# Altium schematic sheet Sheet2s.SchDoc
size A1; PageSetup: Record=PageOptions|CenterHorizontal=True|CenterVertical=True|PrintScale=0.37|XCorrection=1.00|YCorrection=1.00|PrintKind=1|BorderSize=5000000|LeftOffset=0|BottomOffset=0|Orientation=2|PaperLength=1000|PaperWidth=1000|Scale=100|PaperSource=7|PrintQuality=-4|MediaType=1|DitherType=10|PaperKind=16K 184 на 260 мм¦PrintScaleMode=1
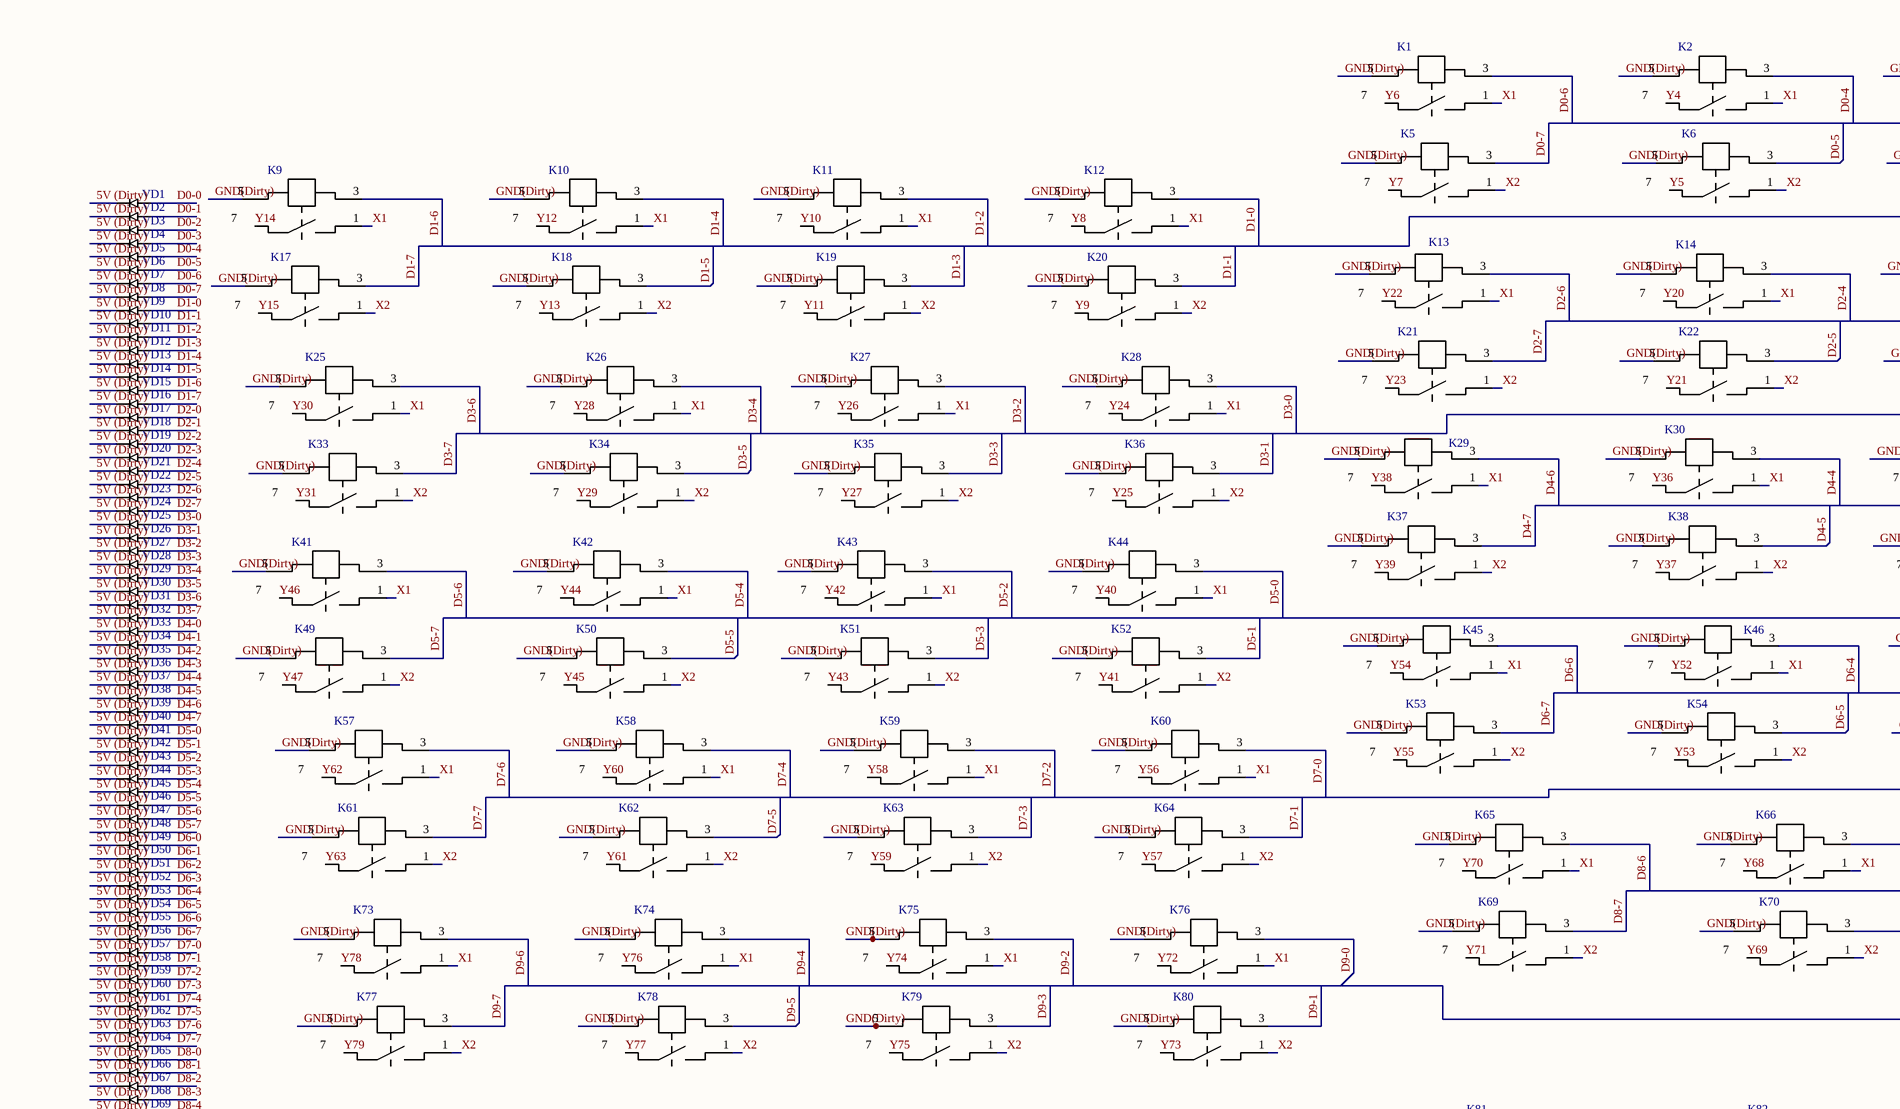
[diagram p0: Sheet2s.SchDoc, top left]
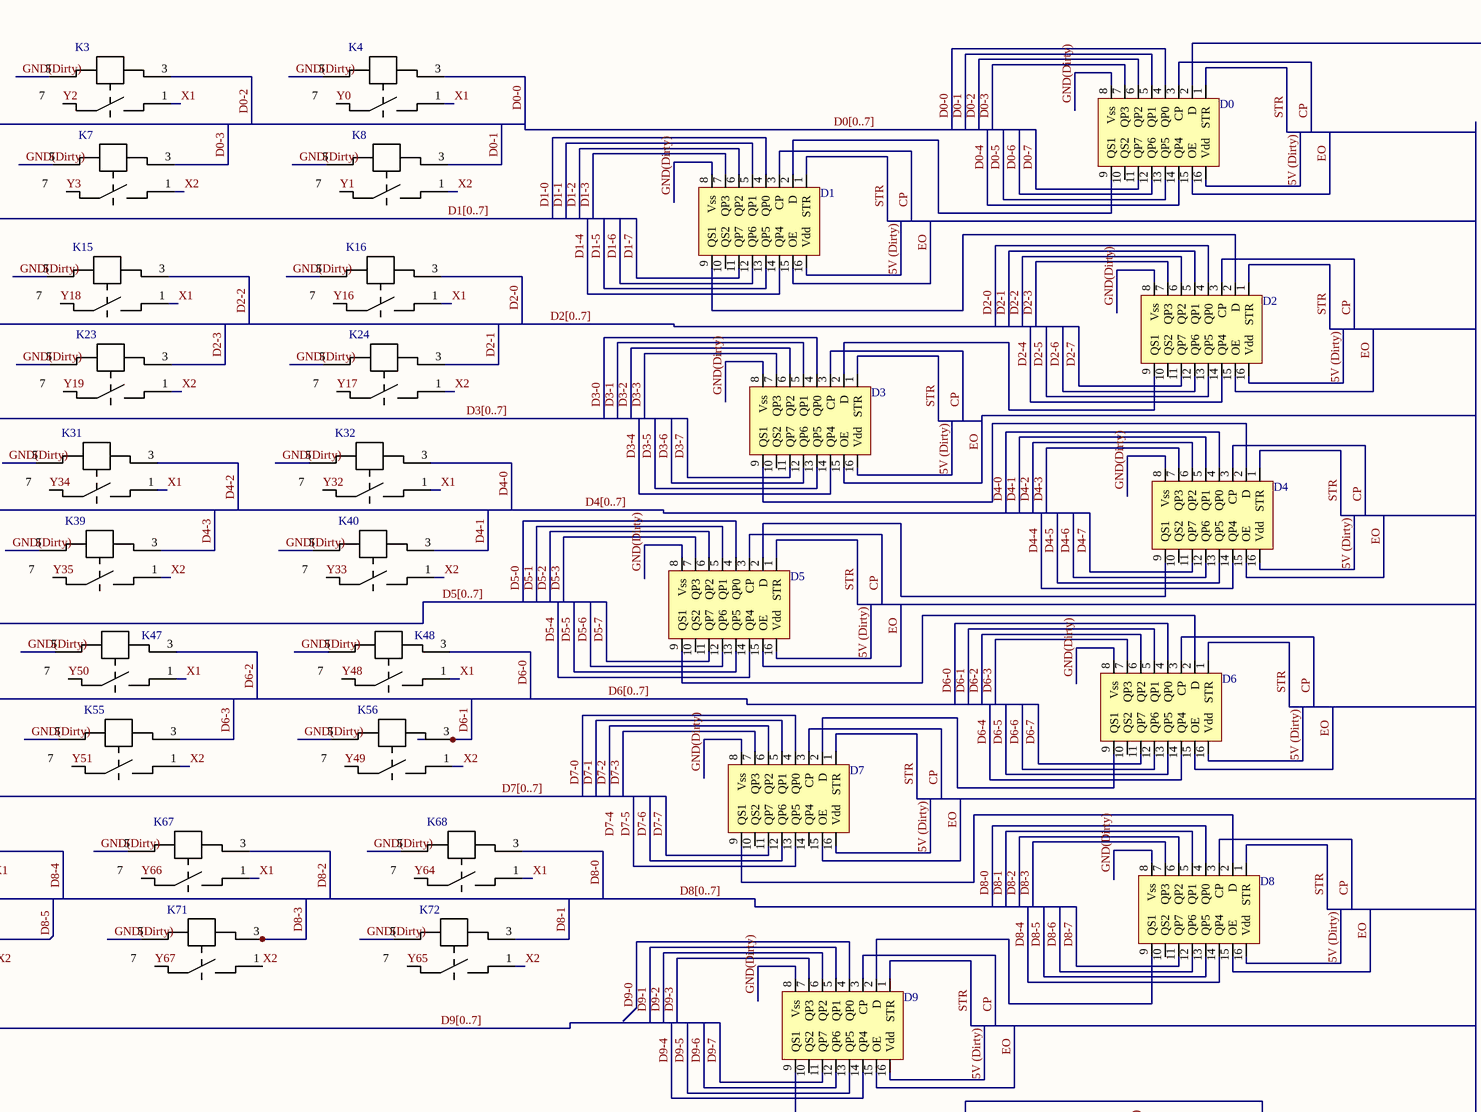
[diagram p1: Sheet2s.SchDoc, top right]
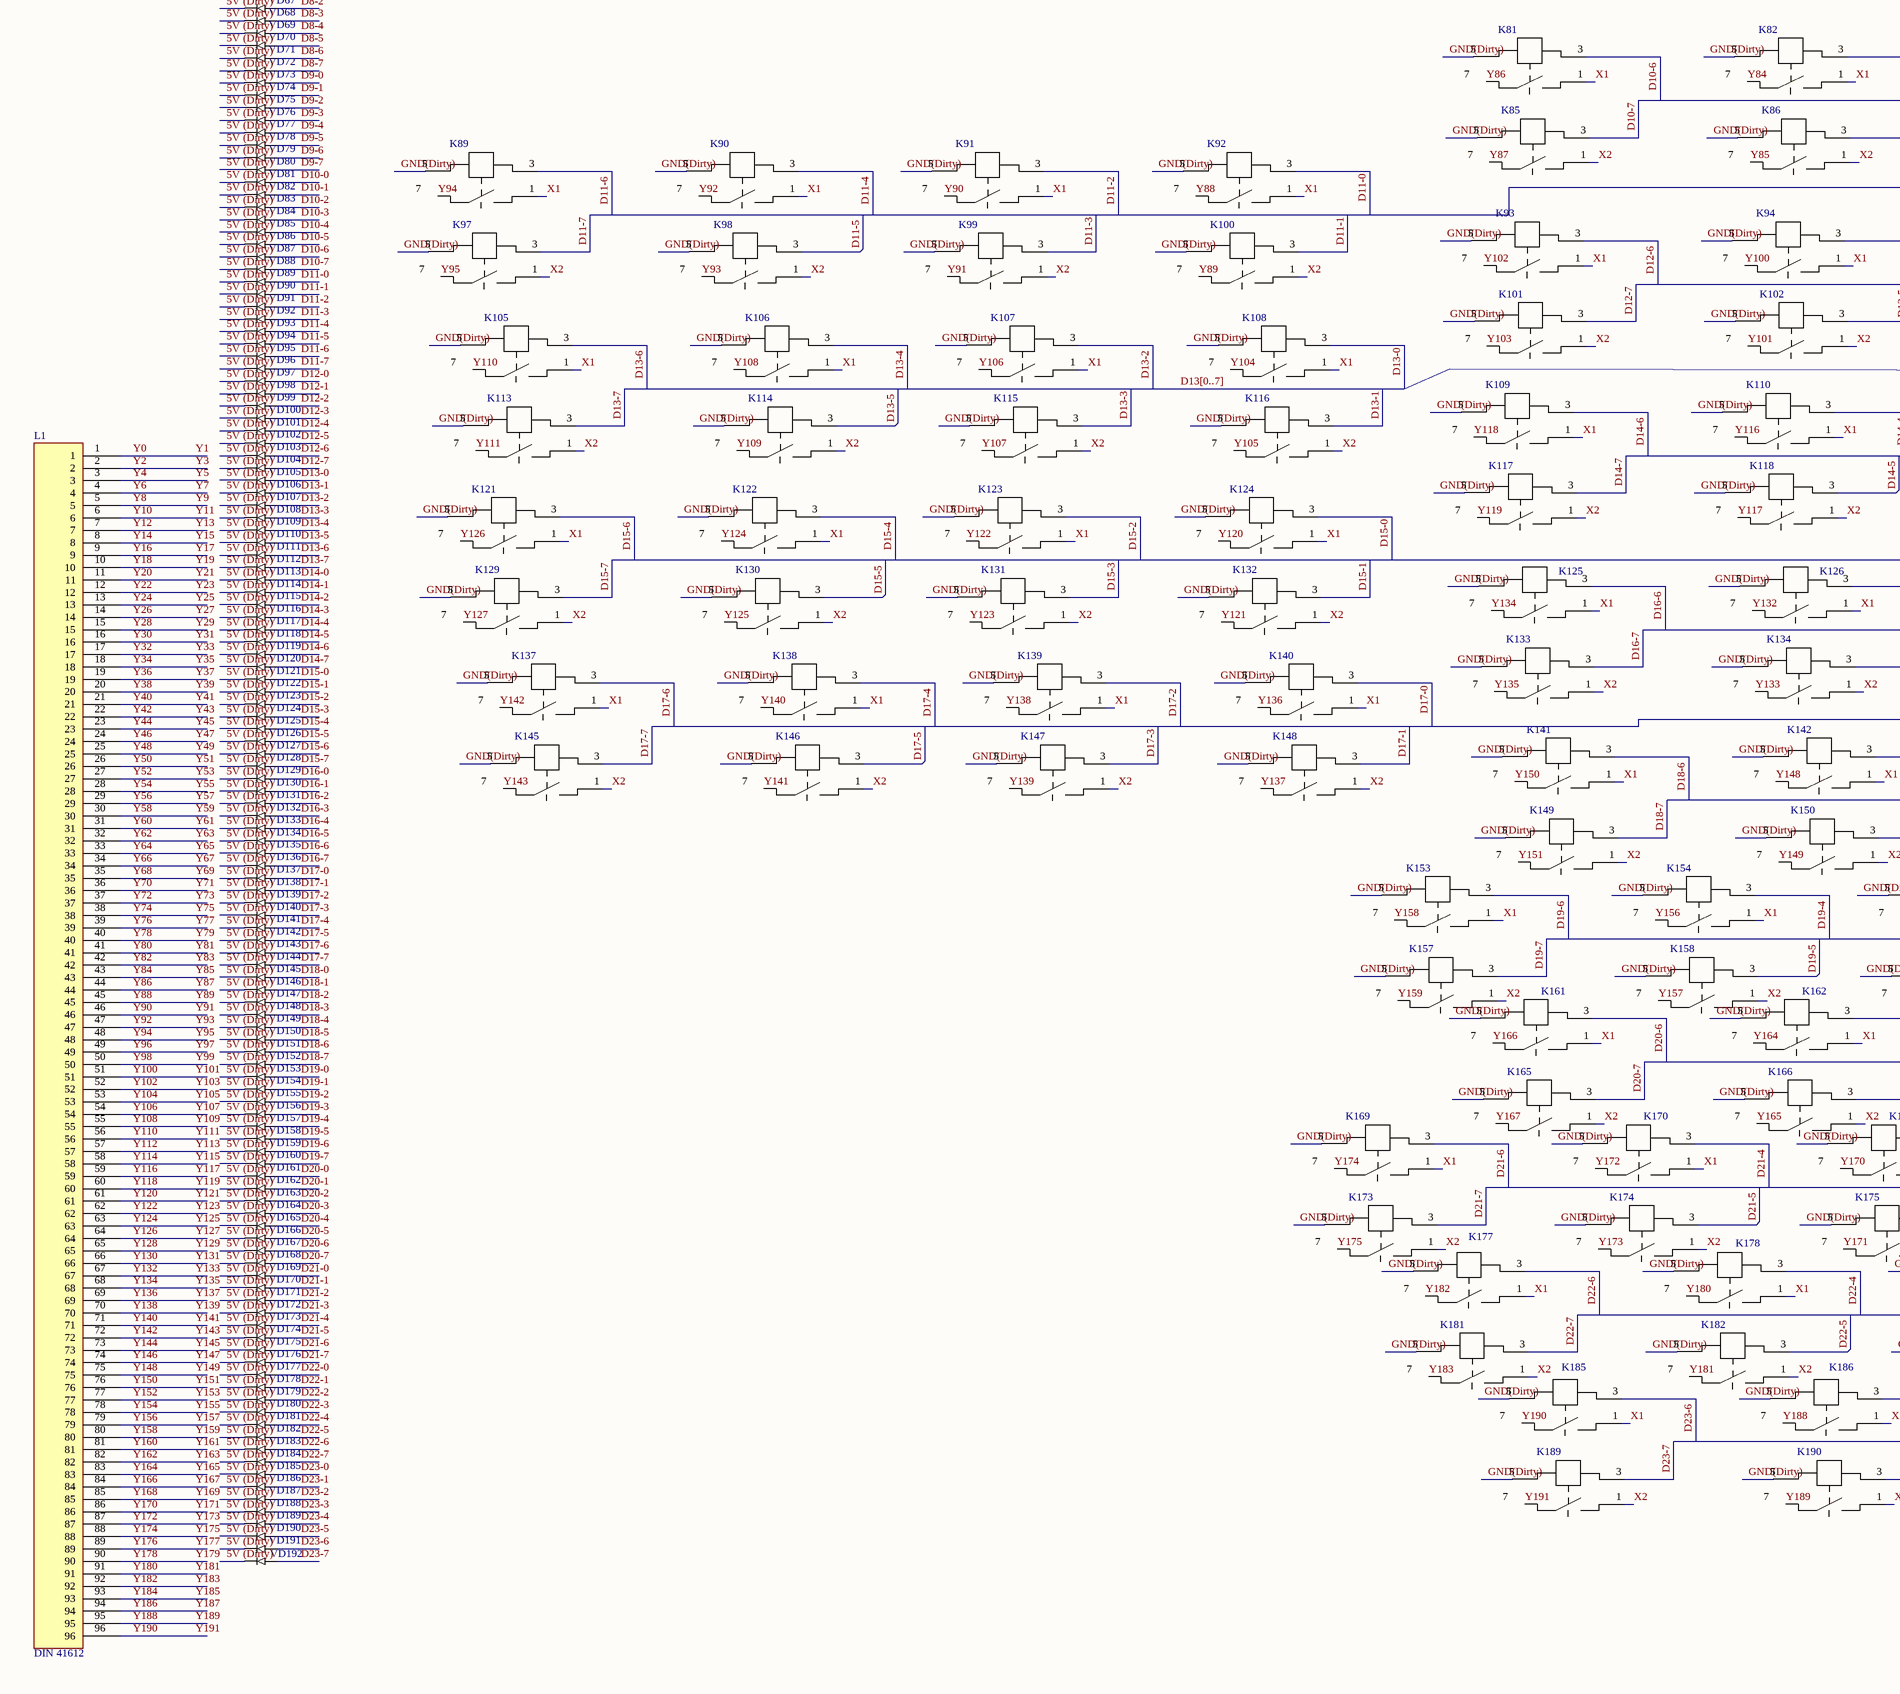
[diagram p2: Sheet2s.SchDoc, bottom left]
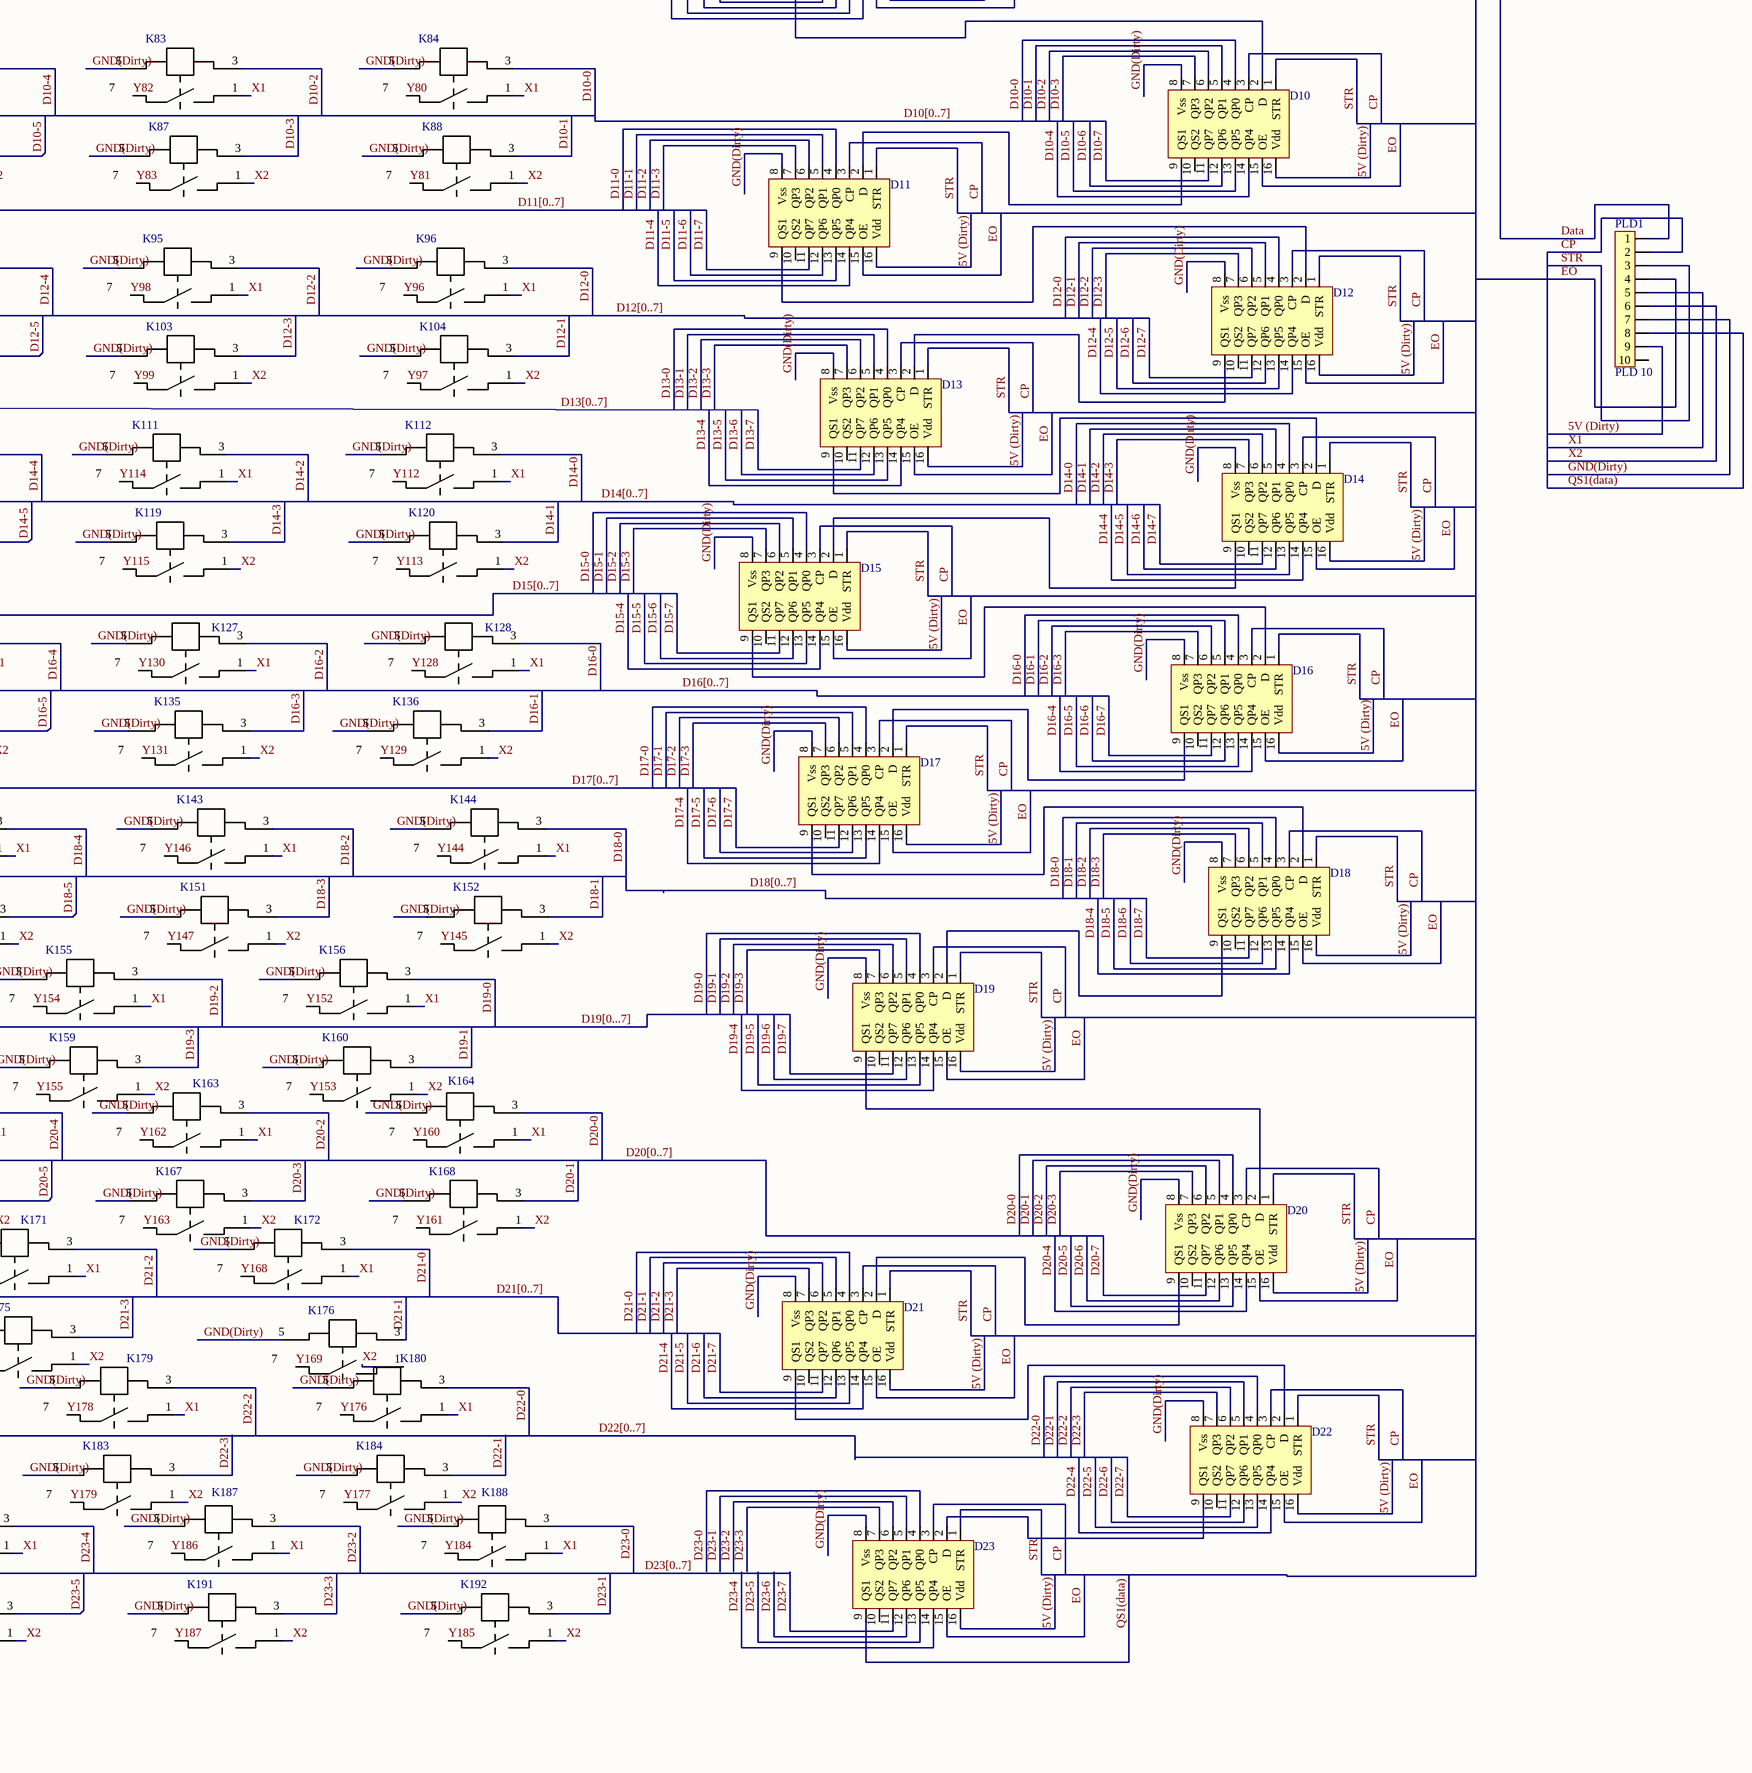
[diagram p3: Sheet2s.SchDoc, bottom right]

## Parts
D0  (no value)  [SOP127P600X175-16N]
D1  (no value)  [SOP127P600X175-16N]
D2  (no value)  [SOP127P600X175-16N]
D3  (no value)  [SOP127P600X175-16N]
D4  (no value)  [SOP127P600X175-16N]
D5  (no value)  [SOP127P600X175-16N]
D6  (no value)  [SOP127P600X175-16N]
D7  (no value)  [SOP127P600X175-16N]
D8  (no value)  [SOP127P600X175-16N]
D9  (no value)  [SOP127P600X175-16N]
D10  (no value)  [SOP127P600X175-16N]
D11  (no value)  [SOP127P600X175-16N]
D12  (no value)  [SOP127P600X175-16N]
D13  (no value)  [SOP127P600X175-16N]
D14  (no value)  [SOP127P600X175-16N]
D15  (no value)  [SOP127P600X175-16N]
D16  (no value)  [SOP127P600X175-16N]
D17  (no value)  [SOP127P600X175-16N]
D18  (no value)  [SOP127P600X175-16N]
D19  (no value)  [SOP127P600X175-16N]
D20  (no value)  [SOP127P600X175-16N]
D21  (no value)  [SOP127P600X175-16N]
D22  (no value)  [SOP127P600X175-16N]
D23  (no value)  [SOP127P600X175-16N]
K1  (no value)  [TTR-реле]
K2  (no value)  [TTR-реле]
K3  (no value)  [TTR-реле]
K4  (no value)  [TTR-реле]
K5  (no value)  [TTR-реле]
K6  (no value)  [TTR-реле]
K7  (no value)  [TTR-реле]
K8  (no value)  [TTR-реле]
K9  (no value)  [TTR-реле]
K10  (no value)  [TTR-реле]
K11  (no value)  [TTR-реле]
K12  (no value)  [TTR-реле]
K13  (no value)  [TTR-реле]
K14  (no value)  [TTR-реле]
K15  (no value)  [TTR-реле]
K16  (no value)  [TTR-реле]
K17  (no value)  [TTR-реле]
K18  (no value)  [TTR-реле]
K19  (no value)  [TTR-реле]
K20  (no value)  [TTR-реле]
K21  (no value)  [TTR-реле]
K22  (no value)  [TTR-реле]
K23  (no value)  [TTR-реле]
K24  (no value)  [TTR-реле]
K25  (no value)  [TTR-реле]
K26  (no value)  [TTR-реле]
K27  (no value)  [TTR-реле]
K28  (no value)  [TTR-реле]
K29  (no value)  [TTR-реле]
K30  (no value)  [TTR-реле]
K31  (no value)  [TTR-реле]
K32  (no value)  [TTR-реле]
K33  (no value)  [TTR-реле]
K34  (no value)  [TTR-реле]
K35  (no value)  [TTR-реле]
K36  (no value)  [TTR-реле]
K37  (no value)  [TTR-реле]
K38  (no value)  [TTR-реле]
K39  (no value)  [TTR-реле]
K40  (no value)  [TTR-реле]
K41  (no value)  [TTR-реле]
K42  (no value)  [TTR-реле]
K43  (no value)  [TTR-реле]
K44  (no value)  [TTR-реле]
K45  (no value)  [TTR-реле]
K46  (no value)  [TTR-реле]
K47  (no value)  [TTR-реле]
K48  (no value)  [TTR-реле]
K49  (no value)  [TTR-реле]
K50  (no value)  [TTR-реле]
K51  (no value)  [TTR-реле]
K52  (no value)  [TTR-реле]
K53  (no value)  [TTR-реле]
K54  (no value)  [TTR-реле]
K55  (no value)  [TTR-реле]
K56  (no value)  [TTR-реле]
K57  (no value)  [TTR-реле]
K58  (no value)  [TTR-реле]
K59  (no value)  [TTR-реле]
K60  (no value)  [TTR-реле]
K61  (no value)  [TTR-реле]
K62  (no value)  [TTR-реле]
K63  (no value)  [TTR-реле]
K64  (no value)  [TTR-реле]
K65  (no value)  [TTR-реле]
K66  (no value)  [TTR-реле]
K67  (no value)  [TTR-реле]
K68  (no value)  [TTR-реле]
K69  (no value)  [TTR-реле]
K70  (no value)  [TTR-реле]
K71  (no value)  [TTR-реле]
K72  (no value)  [TTR-реле]
K73  (no value)  [TTR-реле]
K74  (no value)  [TTR-реле]
K75  (no value)  [TTR-реле]
K76  (no value)  [TTR-реле]
K77  (no value)  [TTR-реле]
K78  (no value)  [TTR-реле]
K79  (no value)  [TTR-реле]
K80  (no value)  [TTR-реле]
K81  (no value)  [TTR-реле]
K82  (no value)  [TTR-реле]
K83  (no value)  [TTR-реле]
K84  (no value)  [TTR-реле]
K85  (no value)  [TTR-реле]
K86  (no value)  [TTR-реле]
K87  (no value)  [TTR-реле]
K88  (no value)  [TTR-реле]
K89  (no value)  [TTR-реле]
K90  (no value)  [TTR-реле]
K91  (no value)  [TTR-реле]
K92  (no value)  [TTR-реле]
K93  (no value)  [TTR-реле]
K94  (no value)  [TTR-реле]
K95  (no value)  [TTR-реле]
K96  (no value)  [TTR-реле]
K97  (no value)  [TTR-реле]
K98  (no value)  [TTR-реле]
K99  (no value)  [TTR-реле]
K100  (no value)  [TTR-реле]
K101  (no value)  [TTR-реле]
K102  (no value)  [TTR-реле]
K103  (no value)  [TTR-реле]
K104  (no value)  [TTR-реле]
K105  (no value)  [TTR-реле]
K106  (no value)  [TTR-реле]
K107  (no value)  [TTR-реле]
K108  (no value)  [TTR-реле]
K109  (no value)  [TTR-реле]
K110  (no value)  [TTR-реле]
K111  (no value)  [TTR-реле]
K112  (no value)  [TTR-реле]
K113  (no value)  [TTR-реле]
K114  (no value)  [TTR-реле]
K115  (no value)  [TTR-реле]
K116  (no value)  [TTR-реле]
K117  (no value)  [TTR-реле]
K118  (no value)  [TTR-реле]
K119  (no value)  [TTR-реле]
K120  (no value)  [TTR-реле]
K121  (no value)  [TTR-реле]
K122  (no value)  [TTR-реле]
K123  (no value)  [TTR-реле]
K124  (no value)  [TTR-реле]
K125  (no value)  [TTR-реле]
K126  (no value)  [TTR-реле]
K127  (no value)  [TTR-реле]
K128  (no value)  [TTR-реле]
K129  (no value)  [TTR-реле]
K130  (no value)  [TTR-реле]
K131  (no value)  [TTR-реле]
K132  (no value)  [TTR-реле]
K133  (no value)  [TTR-реле]
K134  (no value)  [TTR-реле]
K135  (no value)  [TTR-реле]
K136  (no value)  [TTR-реле]
K137  (no value)  [TTR-реле]
K138  (no value)  [TTR-реле]
K139  (no value)  [TTR-реле]
K140  (no value)  [TTR-реле]
K141  (no value)  [TTR-реле]
K142  (no value)  [TTR-реле]
K143  (no value)  [TTR-реле]
K144  (no value)  [TTR-реле]
K145  (no value)  [TTR-реле]
K146  (no value)  [TTR-реле]
K147  (no value)  [TTR-реле]
K148  (no value)  [TTR-реле]
K149  (no value)  [TTR-реле]
K150  (no value)  [TTR-реле]
K151  (no value)  [TTR-реле]
K152  (no value)  [TTR-реле]
K153  (no value)  [TTR-реле]
K154  (no value)  [TTR-реле]
K155  (no value)  [TTR-реле]
K156  (no value)  [TTR-реле]
K157  (no value)  [TTR-реле]
K158  (no value)  [TTR-реле]
K159  (no value)  [TTR-реле]
K160  (no value)  [TTR-реле]
K161  (no value)  [TTR-реле]
K162  (no value)  [TTR-реле]
K163  (no value)  [TTR-реле]
K164  (no value)  [TTR-реле]
K165  (no value)  [TTR-реле]
K166  (no value)  [TTR-реле]
K167  (no value)  [TTR-реле]
K168  (no value)  [TTR-реле]
K169  (no value)  [TTR-реле]
K170  (no value)  [TTR-реле]
K171  (no value)  [TTR-реле]
K172  (no value)  [TTR-реле]
K173  (no value)  [TTR-реле]
K174  (no value)  [TTR-реле]
K175  (no value)  [TTR-реле]
K176  (no value)  [TTR-реле]
K177  (no value)  [TTR-реле]
K178  (no value)  [TTR-реле]
K179  (no value)  [TTR-реле]
K180  (no value)  [TTR-реле]
K181  (no value)  [TTR-реле]
K182  (no value)  [TTR-реле]
K183  (no value)  [TTR-реле]
K184  (no value)  [TTR-реле]
K185  (no value)  [TTR-реле]
K186  (no value)  [TTR-реле]
K187  (no value)  [TTR-реле]
K188  (no value)  [TTR-реле]
K189  (no value)  [TTR-реле]
K190  (no value)  [TTR-реле]
K191  (no value)  [TTR-реле]
K192  (no value)  [TTR-реле]
L1  DIN 41612  [DIN41612]
PLD1  PLD 10  [PLD 10]
VD1  BAS216  [BAS216]  (value not drawn)
VD2  BAS216  [BAS216]  (value not drawn)
VD3  BAS216  [BAS216]  (value not drawn)
VD4  BAS216  [BAS216]  (value not drawn)
VD5  BAS216  [BAS216]  (value not drawn)
VD6  BAS216  [BAS216]  (value not drawn)
VD7  BAS216  [BAS216]  (value not drawn)
VD8  BAS216  [BAS216]  (value not drawn)
VD9  BAS216  [BAS216]  (value not drawn)
VD10  BAS216  [BAS216]  (value not drawn)
VD11  BAS216  [BAS216]  (value not drawn)
VD12  BAS216  [BAS216]  (value not drawn)
VD13  BAS216  [BAS216]  (value not drawn)
VD14  BAS216  [BAS216]  (value not drawn)
VD15  BAS216  [BAS216]  (value not drawn)
VD16  BAS216  [BAS216]  (value not drawn)
VD17  BAS216  [BAS216]  (value not drawn)
VD18  BAS216  [BAS216]  (value not drawn)
VD19  BAS216  [BAS216]  (value not drawn)
VD20  BAS216  [BAS216]  (value not drawn)
VD21  BAS216  [BAS216]  (value not drawn)
VD22  BAS216  [BAS216]  (value not drawn)
VD23  BAS216  [BAS216]  (value not drawn)
VD24  BAS216  [BAS216]  (value not drawn)
VD25  BAS216  [BAS216]  (value not drawn)
VD26  BAS216  [BAS216]  (value not drawn)
VD27  BAS216  [BAS216]  (value not drawn)
VD28  BAS216  [BAS216]  (value not drawn)
VD29  BAS216  [BAS216]  (value not drawn)
VD30  BAS216  [BAS216]  (value not drawn)
VD31  BAS216  [BAS216]  (value not drawn)
VD32  BAS216  [BAS216]  (value not drawn)
VD33  BAS216  [BAS216]  (value not drawn)
VD34  BAS216  [BAS216]  (value not drawn)
VD35  BAS216  [BAS216]  (value not drawn)
VD36  BAS216  [BAS216]  (value not drawn)
VD37  BAS216  [BAS216]  (value not drawn)
VD38  BAS216  [BAS216]  (value not drawn)
VD39  BAS216  [BAS216]  (value not drawn)
VD40  BAS216  [BAS216]  (value not drawn)
VD41  BAS216  [BAS216]  (value not drawn)
VD42  BAS216  [BAS216]  (value not drawn)
VD43  BAS216  [BAS216]  (value not drawn)
VD44  BAS216  [BAS216]  (value not drawn)
VD45  BAS216  [BAS216]  (value not drawn)
VD46  BAS216  [BAS216]  (value not drawn)
VD47  BAS216  [BAS216]  (value not drawn)
VD48  BAS216  [BAS216]  (value not drawn)
VD49  BAS216  [BAS216]  (value not drawn)
VD50  BAS216  [BAS216]  (value not drawn)
VD51  BAS216  [BAS216]  (value not drawn)
VD52  BAS216  [BAS216]  (value not drawn)
VD53  BAS216  [BAS216]  (value not drawn)
VD54  BAS216  [BAS216]  (value not drawn)
VD55  BAS216  [BAS216]  (value not drawn)
VD56  BAS216  [BAS216]  (value not drawn)
VD57  BAS216  [BAS216]  (value not drawn)
VD58  BAS216  [BAS216]  (value not drawn)
VD59  BAS216  [BAS216]  (value not drawn)
VD60  BAS216  [BAS216]  (value not drawn)
VD61  BAS216  [BAS216]  (value not drawn)
VD62  BAS216  [BAS216]  (value not drawn)
VD63  BAS216  [BAS216]  (value not drawn)
VD64  BAS216  [BAS216]  (value not drawn)
VD65  BAS216  [BAS216]  (value not drawn)
VD66  BAS216  [BAS216]  (value not drawn)
VD67  BAS216  [BAS216]  (value not drawn)
VD68  BAS216  [BAS216]  (value not drawn)
VD69  BAS216  [BAS216]  (value not drawn)
VD70  BAS216  [BAS216]  (value not drawn)
VD71  BAS216  [BAS216]  (value not drawn)
VD72  BAS216  [BAS216]  (value not drawn)
VD73  BAS216  [BAS216]  (value not drawn)
VD74  BAS216  [BAS216]  (value not drawn)
VD75  BAS216  [BAS216]  (value not drawn)
VD76  BAS216  [BAS216]  (value not drawn)
VD77  BAS216  [BAS216]  (value not drawn)
VD78  BAS216  [BAS216]  (value not drawn)
VD79  BAS216  [BAS216]  (value not drawn)
VD80  BAS216  [BAS216]  (value not drawn)
VD81  BAS216  [BAS216]  (value not drawn)
VD82  BAS216  [BAS216]  (value not drawn)
VD83  BAS216  [BAS216]  (value not drawn)
VD84  BAS216  [BAS216]  (value not drawn)
VD85  BAS216  [BAS216]  (value not drawn)
VD86  BAS216  [BAS216]  (value not drawn)
VD87  BAS216  [BAS216]  (value not drawn)
VD88  BAS216  [BAS216]  (value not drawn)
VD89  BAS216  [BAS216]  (value not drawn)
VD90  BAS216  [BAS216]  (value not drawn)
VD91  BAS216  [BAS216]  (value not drawn)
VD92  BAS216  [BAS216]  (value not drawn)
VD93  BAS216  [BAS216]  (value not drawn)
VD94  BAS216  [BAS216]  (value not drawn)
VD95  BAS216  [BAS216]  (value not drawn)
VD96  BAS216  [BAS216]  (value not drawn)
VD97  BAS216  [BAS216]  (value not drawn)
VD98  BAS216  [BAS216]  (value not drawn)
VD99  BAS216  [BAS216]  (value not drawn)
VD100  BAS216  [BAS216]  (value not drawn)
VD101  BAS216  [BAS216]  (value not drawn)
VD102  BAS216  [BAS216]  (value not drawn)
VD103  BAS216  [BAS216]  (value not drawn)
VD104  BAS216  [BAS216]  (value not drawn)
VD105  BAS216  [BAS216]  (value not drawn)
VD106  BAS216  [BAS216]  (value not drawn)
VD107  BAS216  [BAS216]  (value not drawn)
VD108  BAS216  [BAS216]  (value not drawn)
VD109  BAS216  [BAS216]  (value not drawn)
VD110  BAS216  [BAS216]  (value not drawn)
VD111  BAS216  [BAS216]  (value not drawn)
VD112  BAS216  [BAS216]  (value not drawn)
VD113  BAS216  [BAS216]  (value not drawn)
VD114  BAS216  [BAS216]  (value not drawn)
VD115  BAS216  [BAS216]  (value not drawn)
VD116  BAS216  [BAS216]  (value not drawn)
VD117  BAS216  [BAS216]  (value not drawn)
VD118  BAS216  [BAS216]  (value not drawn)
VD119  BAS216  [BAS216]  (value not drawn)
VD120  BAS216  [BAS216]  (value not drawn)
VD121  BAS216  [BAS216]  (value not drawn)
VD122  BAS216  [BAS216]  (value not drawn)
VD123  BAS216  [BAS216]  (value not drawn)
VD124  BAS216  [BAS216]  (value not drawn)
VD125  BAS216  [BAS216]  (value not drawn)
VD126  BAS216  [BAS216]  (value not drawn)
VD127  BAS216  [BAS216]  (value not drawn)
VD128  BAS216  [BAS216]  (value not drawn)
VD129  BAS216  [BAS216]  (value not drawn)
VD130  BAS216  [BAS216]  (value not drawn)
VD131  BAS216  [BAS216]  (value not drawn)
VD132  BAS216  [BAS216]  (value not drawn)
VD133  BAS216  [BAS216]  (value not drawn)
VD134  BAS216  [BAS216]  (value not drawn)
VD135  BAS216  [BAS216]  (value not drawn)
VD136  BAS216  [BAS216]  (value not drawn)
VD137  BAS216  [BAS216]  (value not drawn)
VD138  BAS216  [BAS216]  (value not drawn)
VD139  BAS216  [BAS216]  (value not drawn)
VD140  BAS216  [BAS216]  (value not drawn)
VD141  BAS216  [BAS216]  (value not drawn)
VD142  BAS216  [BAS216]  (value not drawn)
VD143  BAS216  [BAS216]  (value not drawn)
VD144  BAS216  [BAS216]  (value not drawn)
VD145  BAS216  [BAS216]  (value not drawn)
VD146  BAS216  [BAS216]  (value not drawn)
VD147  BAS216  [BAS216]  (value not drawn)
VD148  BAS216  [BAS216]  (value not drawn)
VD149  BAS216  [BAS216]  (value not drawn)
VD150  BAS216  [BAS216]  (value not drawn)
VD151  BAS216  [BAS216]  (value not drawn)
VD152  BAS216  [BAS216]  (value not drawn)
VD153  BAS216  [BAS216]  (value not drawn)
VD154  BAS216  [BAS216]  (value not drawn)
VD155  BAS216  [BAS216]  (value not drawn)
VD156  BAS216  [BAS216]  (value not drawn)
VD157  BAS216  [BAS216]  (value not drawn)
VD158  BAS216  [BAS216]  (value not drawn)
VD159  BAS216  [BAS216]  (value not drawn)
VD160  BAS216  [BAS216]  (value not drawn)
VD161  BAS216  [BAS216]  (value not drawn)
VD162  BAS216  [BAS216]  (value not drawn)
VD163  BAS216  [BAS216]  (value not drawn)
VD164  BAS216  [BAS216]  (value not drawn)
VD165  BAS216  [BAS216]  (value not drawn)
VD166  BAS216  [BAS216]  (value not drawn)
VD167  BAS216  [BAS216]  (value not drawn)
VD168  BAS216  [BAS216]  (value not drawn)
VD169  BAS216  [BAS216]  (value not drawn)
VD170  BAS216  [BAS216]  (value not drawn)
VD171  BAS216  [BAS216]  (value not drawn)
VD172  BAS216  [BAS216]  (value not drawn)
VD173  BAS216  [BAS216]  (value not drawn)
VD174  BAS216  [BAS216]  (value not drawn)
VD175  BAS216  [BAS216]  (value not drawn)
VD176  BAS216  [BAS216]  (value not drawn)
VD177  BAS216  [BAS216]  (value not drawn)
VD178  BAS216  [BAS216]  (value not drawn)
VD179  BAS216  [BAS216]  (value not drawn)
VD180  BAS216  [BAS216]  (value not drawn)
VD181  BAS216  [BAS216]  (value not drawn)
VD182  BAS216  [BAS216]  (value not drawn)
VD183  BAS216  [BAS216]  (value not drawn)
VD184  BAS216  [BAS216]  (value not drawn)
VD185  BAS216  [BAS216]  (value not drawn)
VD186  BAS216  [BAS216]  (value not drawn)
VD187  BAS216  [BAS216]  (value not drawn)
VD188  BAS216  [BAS216]  (value not drawn)
VD189  BAS216  [BAS216]  (value not drawn)
VD190  BAS216  [BAS216]  (value not drawn)
VD191  BAS216  [BAS216]  (value not drawn)
VD192  BAS216  [BAS216]  (value not drawn)

## Nets
5V (Dirty): D0.16(Vdd) D1.16(Vdd) D2.16(Vdd) D3.16(Vdd) D4.16(Vdd) D5.16(Vdd) D6.16(Vdd) D7.16(Vdd) D8.16(Vdd) D9.16(Vdd) D10.16(Vdd) D11.16(Vdd) D12.16(Vdd) D13.16(Vdd) D14.16(Vdd) D15.16(Vdd) D16.16(Vdd) D17.16(Vdd) D18.16(Vdd) D19.16(Vdd) D20.16(Vdd) D21.16(Vdd) D22.16(Vdd) D23.16(Vdd) PLD1.9 VD1.K(Katod) VD2.K(Katod) VD3.K(Katod) VD4.K(Katod) VD5.K(Katod) VD6.K(Katod) VD7.K(Katod) VD8.K(Katod) VD9.K(Katod) VD10.K(Katod) VD11.K(Katod) VD12.K(Katod) VD13.K(Katod) VD14.K(Katod) VD15.K(Katod) VD16.K(Katod) VD17.K(Katod) VD18.K(Katod) VD19.K(Katod) VD20.K(Katod) VD21.K(Katod) VD22.K(Katod) VD23.K(Katod) VD24.K(Katod) VD25.K(Katod) VD26.K(Katod) VD27.K(Katod) VD28.K(Katod) VD29.K(Katod) VD30.K(Katod) VD31.K(Katod) VD32.K(Katod) VD33.K(Katod) VD34.K(Katod) VD35.K(Katod) VD36.K(Katod) VD37.K(Katod) VD38.K(Katod) VD39.K(Katod) VD40.K(Katod) VD41.K(Katod) VD42.K(Katod) VD43.K(Katod) VD44.K(Katod) VD45.K(Katod) VD46.K(Katod) VD47.K(Katod) VD48.K(Katod) VD49.K(Katod) VD50.K(Katod) VD51.K(Katod) VD52.K(Katod) VD53.K(Katod) VD54.K(Katod) VD55.K(Katod) VD56.K(Katod) VD57.K(Katod) VD58.K(Katod) VD59.K(Katod) VD60.K(Katod) VD61.K(Katod) VD62.K(Katod) VD63.K(Katod) VD64.K(Katod) VD65.K(Katod) VD66.K(Katod) VD67.K(Katod) VD68.K(Katod) VD69.K(Katod) VD70.K(Katod) VD71.K(Katod) VD72.K(Katod) VD73.K(Katod) VD74.K(Katod) VD75.K(Katod) VD76.K(Katod) VD77.K(Katod) VD78.K(Katod) VD79.K(Katod) VD80.K(Katod) VD81.K(Katod) VD82.K(Katod) VD83.K(Katod) VD84.K(Katod) VD85.K(Katod) VD86.K(Katod) VD87.K(Katod) VD88.K(Katod) VD89.K(Katod) VD90.K(Katod) VD91.K(Katod) VD92.K(Katod) VD93.K(Katod) VD94.K(Katod) VD95.K(Katod) VD96.K(Katod) VD97.K(Katod) VD98.K(Katod) VD99.K(Katod) VD100.K(Katod) VD101.K(Katod) VD102.K(Katod) VD103.K(Katod) VD104.K(Katod) VD105.K(Katod) VD106.K(Katod) VD107.K(Katod) VD108.K(Katod) VD109.K(Katod) VD110.K(Katod) VD111.K(Katod) VD112.K(Katod) VD113.K(Katod) VD114.K(Katod) VD115.K(Katod) VD116.K(Katod) VD117.K(Katod) VD118.K(Katod) VD119.K(Katod) VD120.K(Katod) VD121.K(Katod) VD122.K(Katod) VD123.K(Katod) VD124.K(Katod) VD125.K(Katod) VD126.K(Katod) VD127.K(Katod) VD128.K(Katod) VD129.K(Katod) VD130.K(Katod) VD131.K(Katod) VD132.K(Katod) VD133.K(Katod) VD134.K(Katod) VD135.K(Katod) VD136.K(Katod) VD137.K(Katod) VD138.K(Katod) VD139.K(Katod) VD140.K(Katod) VD141.K(Katod) VD142.K(Katod) VD143.K(Katod) VD144.K(Katod) VD145.K(Katod) VD146.K(Katod) VD147.K(Katod) VD148.K(Katod) VD149.K(Katod) VD150.K(Katod) VD151.K(Katod) VD152.K(Katod) VD153.K(Katod) VD154.K(Katod) VD155.K(Katod) VD156.K(Katod) VD157.K(Katod) VD158.K(Katod) VD159.K(Katod) VD160.K(Katod) VD161.K(Katod) VD162.K(Katod) VD163.K(Katod) VD164.K(Katod) VD165.K(Katod) VD166.K(Katod) VD167.K(Katod) VD168.K(Katod) VD169.K(Katod) VD170.K(Katod) VD171.K(Katod) VD172.K(Katod) VD173.K(Katod) VD174.K(Katod) VD175.K(Katod) VD176.K(Katod) VD177.K(Katod) VD178.K(Katod) VD179.K(Katod) VD180.K(Katod) VD181.K(Katod) VD182.K(Katod) VD183.K(Katod) VD184.K(Katod) VD185.K(Katod) VD186.K(Katod) VD187.K(Katod) VD188.K(Katod) VD189.K(Katod) VD190.K(Katod) VD191.K(Katod) VD192.K(Katod)
CP: D0.3(CP) D1.3(CP) D2.3(CP) D3.3(CP) D4.3(CP) D5.3(CP) D6.3(CP) D7.3(CP) D8.3(CP) D9.3(CP) D10.3(CP) D11.3(CP) D12.3(CP) D13.3(CP) D14.3(CP) D15.3(CP) D16.3(CP) D17.3(CP) D18.3(CP) D19.3(CP) D20.3(CP) D21.3(CP) D22.3(CP) D23.3(CP) PLD1.2
D0-0: D0.4(QP0) K4.3 VD1.A(Anod)
D0-1: D0.5(QP1) K8.3 VD2.A(Anod)
D0-2: D0.6(QP2) K3.3 VD3.A(Anod)
D0-3: D0.7(QP3) K7.3 VD4.A(Anod)
D0-4: D0.14(QP4) K2.3 VD5.A(Anod)
D0-5: D0.13(QP5) K6.3 VD6.A(Anod)
D0-6: D0.12(QP6) K1.3 VD7.A(Anod)
D0-7: D0.11(QP7) K5.3 VD8.A(Anod)
D1-0: D1.4(QP0) K12.3 VD9.A(Anod)
D1-1: D1.5(QP1) K20.3 VD10.A(Anod)
D1-2: D1.6(QP2) K11.3 VD11.A(Anod)
D1-3: D1.7(QP3) K19.3 VD12.A(Anod)
D1-4: D1.14(QP4) K10.3 VD13.A(Anod)
D1-5: D1.13(QP5) K18.3 VD14.A(Anod)
D1-6: D1.12(QP6) K9.3 VD15.A(Anod)
D1-7: D1.11(QP7) K17.3 VD16.A(Anod)
D2-0: D2.4(QP0) K16.3 VD17.A(Anod)
D2-1: D2.5(QP1) K24.3 VD18.A(Anod)
D2-2: D2.6(QP2) K15.3 VD19.A(Anod)
D2-3: D2.7(QP3) K23.3 VD20.A(Anod)
D2-4: D2.14(QP4) K14.3 VD21.A(Anod)
D2-5: D2.13(QP5) K22.3 VD22.A(Anod)
D2-6: D2.12(QP6) K13.3 VD23.A(Anod)
D2-7: D2.11(QP7) K21.3 VD24.A(Anod)
D3-0: D3.4(QP0) K28.3 VD25.A(Anod)
D3-1: D3.5(QP1) K36.3 VD26.A(Anod)
D3-2: D3.6(QP2) K27.3 VD27.A(Anod)
D3-3: D3.7(QP3) K35.3 VD28.A(Anod)
D3-4: D3.14(QP4) K26.3 VD29.A(Anod)
D3-5: D3.13(QP5) K34.3 VD30.A(Anod)
D3-6: D3.12(QP6) K25.3 VD31.A(Anod)
D3-7: D3.11(QP7) K33.3 VD32.A(Anod)
D4-0: D4.4(QP0) K32.3 VD33.A(Anod)
D4-1: D4.5(QP1) K40.3 VD34.A(Anod)
D4-2: D4.6(QP2) K31.3 VD35.A(Anod)
D4-3: D4.7(QP3) K39.3 VD36.A(Anod)
D4-4: D4.14(QP4) K30.3 VD37.A(Anod)
D4-5: D4.13(QP5) K38.3 VD38.A(Anod)
D4-6: D4.12(QP6) K29.3 VD39.A(Anod)
D4-7: D4.11(QP7) K37.3 VD40.A(Anod)
D5-0: D5.4(QP0) K44.3 VD41.A(Anod)
D5-1: D5.5(QP1) K52.3 VD42.A(Anod)
D5-2: D5.6(QP2) K43.3 VD43.A(Anod)
D5-3: D5.7(QP3) K51.3 VD44.A(Anod)
D5-4: D5.14(QP4) K42.3 VD45.A(Anod)
D5-5: D5.13(QP5) K50.3 VD46.A(Anod)
D5-6: D5.12(QP6) K41.3 VD47.A(Anod)
D5-7: D5.11(QP7) K49.3 VD48.A(Anod)
D6-0: D6.4(QP0) K48.3 VD49.A(Anod)
D6-1: D6.5(QP1) K56.3 VD50.A(Anod)
D6-2: D6.6(QP2) K47.3 VD51.A(Anod)
D6-3: D6.7(QP3) K55.3 VD52.A(Anod)
D6-4: D6.14(QP4) K46.3 VD53.A(Anod)
D6-5: D6.13(QP5) K54.3 VD54.A(Anod)
D6-6: D6.12(QP6) K45.3 VD55.A(Anod)
D6-7: D6.11(QP7) K53.3 VD56.A(Anod)
D7-0: D7.4(QP0) K60.3 VD57.A(Anod)
D7-1: D7.5(QP1) K64.3 VD58.A(Anod)
D7-2: D7.6(QP2) K59.3 VD59.A(Anod)
D7-3: D7.7(QP3) K63.3 VD60.A(Anod)
D7-4: K58.3 VD61.A(Anod)
D7-5: D7.13(QP5) K62.3 VD62.A(Anod)
D7-6: D7.12(QP6) K57.3 VD63.A(Anod)
D7-7: D7.11(QP7) K61.3 VD64.A(Anod)
D8-0: D8.4(QP0) K68.3 VD65.A(Anod)
D8-1: D8.5(QP1) K72.3 VD66.A(Anod)
D8-2: D8.6(QP2) K67.3 VD67.A(Anod)
D8-3: D8.7(QP3) K71.3 VD68.A(Anod)
D8-4: D8.14(QP4) K66.3 VD69.A(Anod)
D8-5: D8.13(QP5) K70.3 VD70.A(Anod)
D8-6: D8.12(QP6) K65.3 VD71.A(Anod)
D8-7: D8.11(QP7) K69.3 VD72.A(Anod)
D9-0: D9.4(QP0) K76.3 VD73.A(Anod)
D9-1: D9.5(QP1) K80.3 VD74.A(Anod)
D9-2: D9.6(QP2) K75.3 VD75.A(Anod)
D9-3: D9.7(QP3) K79.3 VD76.A(Anod)
D9-4: D9.14(QP4) K74.3 VD77.A(Anod)
D9-5: D9.13(QP5) K78.3 VD78.A(Anod)
D9-6: D9.12(QP6) K73.3 VD79.A(Anod)
D9-7: D9.11(QP7) K77.3 VD80.A(Anod)
D10-0: D10.4(QP0) K84.3 VD81.A(Anod)
D10-1: D10.5(QP1) K88.3 VD82.A(Anod)
D10-2: D10.6(QP2) K83.3 VD83.A(Anod)
D10-3: D10.7(QP3) K87.3 VD84.A(Anod)
D10-4: D10.14(QP4) K82.3 VD85.A(Anod)
D10-5: D10.13(QP5) K86.3 VD86.A(Anod)
D10-6: D10.12(QP6) K81.3 VD87.A(Anod)
D10-7: D10.11(QP7) K85.3 VD88.A(Anod)
D11-0: D11.4(QP0) K92.3 VD89.A(Anod)
D11-1: D11.5(QP1) K100.3 VD90.A(Anod)
D11-2: D11.6(QP2) K91.3 VD91.A(Anod)
D11-3: D11.7(QP3) K99.3 VD92.A(Anod)
D11-4: D11.14(QP4) K90.3 VD93.A(Anod)
D11-5: D11.13(QP5) K98.3 VD94.A(Anod)
D11-6: D11.12(QP6) K89.3 VD95.A(Anod)
D11-7: D11.11(QP7) K97.3 VD96.A(Anod)
D12-0: D12.4(QP0) K96.3 VD97.A(Anod)
D12-1: D12.5(QP1) K104.3 VD98.A(Anod)
D12-2: D12.6(QP2) K95.3 VD99.A(Anod)
D12-3: D12.7(QP3) K103.3 VD100.A(Anod)
D12-4: D12.14(QP4) K94.3 VD101.A(Anod)
D12-5: D12.13(QP5) K102.3 VD102.A(Anod)
D12-6: D12.12(QP6) K93.3 VD103.A(Anod)
D12-7: D12.11(QP7) K101.3 VD104.A(Anod)
D13-0: D13.4(QP0) K108.3 VD105.A(Anod)
D13-1: D13.5(QP1) K116.3 VD106.A(Anod)
D13-2: D13.6(QP2) K107.3 VD107.A(Anod)
D13-3: D13.7(QP3) K115.3 VD108.A(Anod)
D13-4: D13.14(QP4) K106.3 VD109.A(Anod)
D13-5: D13.13(QP5) K114.3 VD110.A(Anod)
D13-6: D13.12(QP6) K105.3 VD111.A(Anod)
D13-7: D13.11(QP7) K113.3 VD112.A(Anod)
D14-0: D14.4(QP0) K112.3 VD113.A(Anod)
D14-1: D14.5(QP1) K120.3 VD114.A(Anod)
D14-2: D14.6(QP2) K111.3 VD115.A(Anod)
D14-3: D14.7(QP3) K119.3 VD116.A(Anod)
D14-4: D14.14(QP4) K110.3 VD117.A(Anod)
D14-5: D14.13(QP5) K118.3 VD118.A(Anod)
D14-6: D14.12(QP6) K109.3 VD119.A(Anod)
D14-7: D14.11(QP7) K117.3 VD120.A(Anod)
D15-0: D15.4(QP0) K124.3 VD121.A(Anod)
D15-1: D15.5(QP1) K132.3 VD122.A(Anod)
D15-2: D15.6(QP2) K123.3 VD123.A(Anod)
D15-3: D15.7(QP3) K131.3 VD124.A(Anod)
D15-4: D15.14(QP4) K122.3 VD125.A(Anod)
D15-5: D15.13(QP5) K130.3 VD126.A(Anod)
D15-6: D15.12(QP6) K121.3 VD127.A(Anod)
D15-7: D15.11(QP7) K129.3 VD128.A(Anod)
D16-0: D16.4(QP0) K128.3 VD129.A(Anod)
D16-1: D16.5(QP1) K136.3 VD130.A(Anod)
D16-2: D16.6(QP2) K127.3 VD131.A(Anod)
D16-3: D16.7(QP3) K135.3 VD132.A(Anod)
D16-4: D16.14(QP4) K126.3 VD133.A(Anod)
D16-5: D16.13(QP5) K134.3 VD134.A(Anod)
D16-6: D16.12(QP6) K125.3 VD135.A(Anod)
D16-7: D16.11(QP7) K133.3 VD136.A(Anod)
D17-0: D17.4(QP0) K140.3 VD137.A(Anod)
D17-1: D17.5(QP1) K148.3 VD138.A(Anod)
D17-2: D17.6(QP2) K139.3 VD139.A(Anod)
D17-3: D17.7(QP3) K147.3 VD140.A(Anod)
D17-4: D17.14(QP4) K138.3 VD141.A(Anod)
D17-5: D17.13(QP5) K146.3 VD142.A(Anod)
D17-6: D17.12(QP6) K137.3 VD143.A(Anod)
D17-7: D17.11(QP7) K145.3 VD144.A(Anod)
D18-0: D18.4(QP0) K144.3 VD145.A(Anod)
D18-1: D18.5(QP1) K152.3 VD146.A(Anod)
D18-2: D18.6(QP2) K143.3 VD147.A(Anod)
D18-3: D18.7(QP3) K151.3 VD148.A(Anod)
D18-4: D18.14(QP4) K142.3 VD149.A(Anod)
D18-5: D18.13(QP5) K150.3 VD150.A(Anod)
D18-6: D18.12(QP6) K141.3 VD151.A(Anod)
D18-7: D18.11(QP7) K149.3 VD152.A(Anod)
D19-0: D19.4(QP0) K156.3 VD153.A(Anod)
D19-1: D19.5(QP1) K160.3 VD154.A(Anod)
D19-2: D19.6(QP2) K155.3 VD155.A(Anod)
D19-3: D19.7(QP3) K159.3 VD156.A(Anod)
D19-4: D19.14(QP4) K154.3 VD157.A(Anod)
D19-5: D19.13(QP5) K158.3 VD158.A(Anod)
D19-6: D19.12(QP6) K153.3 VD159.A(Anod)
D19-7: D19.11(QP7) K157.3 VD160.A(Anod)
D20-0: D20.4(QP0) K164.3 VD161.A(Anod)
D20-1: D20.5(QP1) K168.3 VD162.A(Anod)
D20-2: D20.6(QP2) K163.3 VD163.A(Anod)
D20-3: D20.7(QP3) K167.3 VD164.A(Anod)
D20-4: D20.14(QP4) K162.3 VD165.A(Anod)
D20-5: D20.13(QP5) K166.3 VD166.A(Anod)
D20-6: D20.12(QP6) K161.3 VD167.A(Anod)
D20-7: D20.11(QP7) K165.3 VD168.A(Anod)
D21-0: D21.4(QP0) K172.3 VD169.A(Anod)
D21-1: D21.5(QP1) K176.3 VD170.A(Anod)
D21-2: D21.6(QP2) K171.3 VD171.A(Anod)
D21-3: D21.7(QP3) K175.3 VD172.A(Anod)
D21-4: D21.14(QP4) K170.3 VD173.A(Anod)
D21-5: D21.13(QP5) K174.3 VD174.A(Anod)
D21-6: D21.12(QP6) K169.3 VD175.A(Anod)
D21-7: D21.11(QP7) K173.3 VD176.A(Anod)
D22-0: D22.4(QP0) K180.3 VD177.A(Anod)
D22-1: D22.5(QP1) K184.3 VD178.A(Anod)
D22-2: D22.6(QP2) K179.3 VD179.A(Anod)
D22-3: D22.7(QP3) K183.3 VD180.A(Anod)
D22-4: D22.14(QP4) K178.3 VD181.A(Anod)
D22-5: D22.13(QP5) K182.3 VD182.A(Anod)
D22-6: D22.12(QP6) K177.3 VD183.A(Anod)
D22-7: D22.11(QP7) K181.3 VD184.A(Anod)
D23-0: D23.4(QP0) K188.3 VD185.A(Anod)
D23-1: D23.5(QP1) K192.3 VD186.A(Anod)
D23-2: D23.6(QP2) K187.3 VD187.A(Anod)
D23-3: D23.7(QP3) K191.3 VD188.A(Anod)
D23-4: D23.14(QP4) K186.3 VD189.A(Anod)
D23-5: D23.13(QP5) K190.3 VD190.A(Anod)
D23-6: D23.12(QP6) K185.3 VD191.A(Anod)
D23-7: D23.11(QP7) K189.3 VD192.A(Anod)
Data: D0.2(D) PLD1.1
EO: D0.15(OE) D1.15(OE) D2.15(OE) D3.15(OE) D4.15(OE) D5.15(OE) D6.15(OE) D7.15(OE) D8.15(OE) D9.15(OE) D10.15(OE) D11.15(OE) D12.15(OE) D13.15(OE) D14.15(OE) D15.15(OE) D16.15(OE) D17.15(OE) D18.15(OE) D19.15(OE) D20.15(OE) D21.15(OE) D22.15(OE) D23.15(OE) PLD1.4
GND(Dirty): D0.8(Vss) D1.8(Vss) D2.8(Vss) D3.8(Vss) D4.8(Vss) D5.8(Vss) D6.8(Vss) D7.8(Vss) D8.8(Vss) D9.8(Vss) D10.8(Vss) D11.8(Vss) D12.8(Vss) D13.8(Vss) D14.8(Vss) D15.8(Vss) D16.8(Vss) D17.8(Vss) D18.8(Vss) D19.8(Vss) D20.8(Vss) D21.8(Vss) D22.8(Vss) D23.8(Vss) K1.5 K2.5 K3.5 K4.5 K5.5 K6.5 K7.5 K8.5 K9.5 K10.5 K11.5 K12.5 K13.5 K14.5 K15.5 K16.5 K17.5 K18.5 K19.5 K20.5 K21.5 K22.5 K23.5 K24.5 K25.5 K26.5 K27.5 K28.5 K29.5 K30.5 K31.5 K32.5 K33.5 K34.5 K35.5 K36.5 K37.5 K38.5 K39.5 K40.5 K41.5 K42.5 K43.5 K44.5 K45.5 K46.5 K47.5 K48.5 K49.5 K50.5 K51.5 K52.5 K53.5 K54.5 K55.5 K56.5 K57.5 K58.5 K59.5 K60.5 K61.5 K62.5 K63.5 K64.5 K65.5 K66.5 K67.5 K68.5 K69.5 K70.5 K71.5 K72.5 K73.5 K74.5 K75.5 K76.5 K77.5 K78.5 K79.5 K80.5 K81.5 K82.5 K83.5 K84.5 K85.5 K86.5 K87.5 K88.5 K89.5 K90.5 K91.5 K92.5 K93.5 K94.5 K95.5 K96.5 K97.5 K98.5 K99.5 K100.5 K101.5 K102.5 K103.5 K104.5 K105.5 K106.5 K107.5 K108.5 K109.5 K110.5 K111.5 K112.5 K113.5 K114.5 K115.5 K116.5 K117.5 K118.5 K119.5 K120.5 K121.5 K122.5 K123.5 K124.5 K125.5 K126.5 K127.5 K128.5 K129.5 K130.5 K131.5 K132.5 K133.5 K134.5 K135.5 K136.5 K137.5 K138.5 K139.5 K140.5 K141.5 K142.5 K143.5 K144.5 K145.5 K146.5 K147.5 K148.5 K149.5 K150.5 K151.5 K152.5 K153.5 K154.5 K155.5 K156.5 K157.5 K158.5 K159.5 K160.5 K161.5 K162.5 K163.5 K164.5 K165.5 K166.5 K167.5 K168.5 K169.5 K170.5 K171.5 K172.5 K173.5 K174.5 K175.5 K176.5 K177.5 K178.5 K179.5 K180.5 K181.5 K182.5 K183.5 K184.5 K185.5 K186.5 K187.5 K188.5 K189.5 K190.5 K191.5 K192.5 PLD1.7
QS1(data): D23.9(QS1) PLD1.8
STR: D0.1(STR) D1.1(STR) D2.1(STR) D3.1(STR) D4.1(STR) D5.1(STR) D6.1(STR) D7.1(STR) D8.1(STR) D9.1(STR) D10.1(STR) D11.1(STR) D12.1(STR) D13.1(STR) D14.1(STR) D15.1(STR) D16.1(STR) D17.1(STR) D18.1(STR) D19.1(STR) D20.1(STR) D21.1(STR) D22.1(STR) D23.1(STR) PLD1.3
X1: K1.1 K2.1 K3.1 K4.1 K9.1 K10.1 K11.1 K12.1 K13.1 K14.1 K15.1 K16.1 K25.1 K26.1 K27.1 K28.1 K29.1 K30.1 K31.1 K32.1 K41.1 K42.1 K43.1 K44.1 K45.1 K46.1 K47.1 K48.1 K57.1 K58.1 K59.1 K60.1 K65.1 K66.1 K67.1 K68.1 K73.1 K74.1 K75.1 K76.1 K81.1 K82.1 K83.1 K84.1 K89.1 K90.1 K91.1 K92.1 K93.1 K94.1 K95.1 K96.1 K105.1 K106.1 K107.1 K108.1 K109.1 K110.1 K111.1 K112.1 K121.1 K122.1 K123.1 K124.1 K125.1 K126.1 K127.1 K128.1 K137.1 K138.1 K139.1 K140.1 K141.1 K142.1 K143.1 K144.1 K153.1 K154.1 K155.1 K156.1 K161.1 K162.1 K163.1 K164.1 K169.1 K170.1 K171.1 K172.1 K177.1 K178.1 K179.1 K180.1 K185.1 K186.1 K187.1 K188.1 PLD1.5
X2: K5.1 K6.1 K7.1 K8.1 K17.1 K18.1 K19.1 K20.1 K21.1 K22.1 K23.1 K24.1 K33.1 K34.1 K35.1 K36.1 K37.1 K38.1 K39.1 K40.1 K49.1 K50.1 K51.1 K52.1 K53.1 K54.1 K55.1 K56.1 K61.1 K62.1 K63.1 K64.1 K69.1 K70.1 K71.1 K72.1 K77.1 K78.1 K79.1 K80.1 K85.1 K86.1 K87.1 K88.1 K97.1 K98.1 K99.1 K100.1 K101.1 K102.1 K103.1 K104.1 K113.1 K114.1 K115.1 K116.1 K117.1 K118.1 K119.1 K120.1 K129.1 K130.1 K131.1 K132.1 K133.1 K134.1 K135.1 K136.1 K145.1 K146.1 K147.1 K148.1 K149.1 K150.1 K151.1 K152.1 K157.1 K158.1 K159.1 K160.1 K165.1 K166.1 K167.1 K168.1 K173.1 K174.1 K175.1 K176.1 K181.1 K182.1 K183.1 K184.1 K189.1 K190.1 K191.1 K192.1 PLD1.6
Y0: K4.7 K8.7 L1.1  [also labelled Y1]
Y2: K3.7 K7.7 L1.2  [also labelled Y3]
Y4: K2.7 K6.7 L1.3  [also labelled Y5]
Y6: K1.7 K5.7 L1.4  [also labelled Y7]
Y8: K12.7 K20.7 L1.5  [also labelled Y9]
Y10: K11.7 K19.7 L1.6  [also labelled Y11]
Y12: K10.7 K18.7 L1.7  [also labelled Y13]
Y14: K9.7 K17.7 L1.8  [also labelled Y15]
Y16: K16.7 K24.7 L1.9  [also labelled Y17]
Y18: K15.7 K23.7 L1.10  [also labelled Y19]
Y20: K14.7 K22.7 L1.11  [also labelled Y21]
Y22: K13.7 K21.7 L1.12  [also labelled Y23]
Y24: K28.7 K36.7 L1.13  [also labelled Y25]
Y26: K27.7 K35.7 L1.14  [also labelled Y27]
Y28: K26.7 K34.7 L1.15  [also labelled Y29]
Y30: K25.7 K33.7 L1.16  [also labelled Y31]
Y32: K32.7 K40.7 L1.17  [also labelled Y33]
Y34: K31.7 K39.7 L1.18  [also labelled Y35]
Y36: K30.7 K38.7 L1.19  [also labelled Y37]
Y38: K29.7 K37.7 L1.20  [also labelled Y39]
Y40: K44.7 K52.7 L1.21  [also labelled Y41]
Y42: K43.7 K51.7 L1.22  [also labelled Y43]
Y44: K42.7 K50.7 L1.23  [also labelled Y45]
Y46: K41.7 K49.7 L1.24  [also labelled Y47]
Y48: K48.7 K56.7 L1.25  [also labelled Y49]
Y50: K47.7 K55.7 L1.26  [also labelled Y51]
Y52: K46.7 K54.7 L1.27  [also labelled Y53]
Y54: K45.7 K53.7 L1.28  [also labelled Y55]
Y56: K60.7 K64.7 L1.29  [also labelled Y57]
Y58: K59.7 K63.7 L1.30  [also labelled Y59]
Y60: K58.7 K62.7 L1.31  [also labelled Y61]
Y62: K57.7 K61.7 L1.32  [also labelled Y63]
Y64: K68.7 K72.7 L1.33  [also labelled Y65]
Y66: K67.7 K71.7 L1.34  [also labelled Y67]
Y68: K66.7 K70.7 L1.35  [also labelled Y69]
Y70: K65.7 K69.7 L1.36  [also labelled Y71]
Y72: K76.7 K80.7 L1.37  [also labelled Y73]
Y74: K75.7 K79.7 L1.38  [also labelled Y75]
Y76: K74.7 K78.7 L1.39  [also labelled Y77]
Y78: K73.7 K77.7 L1.40  [also labelled Y79]
Y80: K84.7 K88.7 L1.41  [also labelled Y81]
Y82: K83.7 K87.7 L1.42  [also labelled Y83]
Y84: K82.7 K86.7 L1.43  [also labelled Y85]
Y86: K81.7 K85.7 L1.44  [also labelled Y87]
Y88: K92.7 K100.7 L1.45  [also labelled Y89]
Y90: K91.7 K99.7 L1.46  [also labelled Y91]
Y92: K90.7 K98.7 L1.47  [also labelled Y93]
Y94: K89.7 K97.7 L1.48  [also labelled Y95]
Y96: K96.7 K104.7 L1.49  [also labelled Y97]
Y98: K95.7 K103.7 L1.50  [also labelled Y99]
Y100: K94.7 K102.7 L1.51  [also labelled Y101]
Y102: K93.7 K101.7 L1.52  [also labelled Y103]
Y104: K108.7 K116.7 L1.53  [also labelled Y105]
Y106: K107.7 K115.7 L1.54  [also labelled Y107]
Y108: K106.7 K114.7 L1.55  [also labelled Y109]
Y110: K105.7 K113.7 L1.56  [also labelled Y111]
Y112: K112.7 K120.7 L1.57  [also labelled Y113]
Y114: K111.7 K119.7 L1.58  [also labelled Y115]
Y116: K110.7 K118.7 L1.59  [also labelled Y117]
Y118: K109.7 K117.7 L1.60  [also labelled Y119]
Y120: K124.7 K132.7 L1.61  [also labelled Y121]
Y122: K123.7 K131.7 L1.62  [also labelled Y123]
Y124: K122.7 K130.7 L1.63  [also labelled Y125]
Y126: K121.7 K129.7 L1.64  [also labelled Y127]
Y128: K128.7 K136.7 L1.65  [also labelled Y129]
Y130: K127.7 K135.7 L1.66  [also labelled Y131]
Y132: K126.7 K134.7 L1.67  [also labelled Y133]
Y134: K125.7 K133.7 L1.68  [also labelled Y135]
Y136: K140.7 K148.7 L1.69  [also labelled Y137]
Y138: K139.7 K147.7 L1.70  [also labelled Y139]
Y140: K138.7 K146.7 L1.71  [also labelled Y141]
Y142: K137.7 K145.7 L1.72  [also labelled Y143]
Y144: K144.7 K152.7 L1.73  [also labelled Y145]
Y146: K143.7 K151.7 L1.74  [also labelled Y147]
Y148: K142.7 K150.7 L1.75  [also labelled Y149]
Y150: K141.7 K149.7 L1.76  [also labelled Y151]
Y152: K156.7 K160.7 L1.77  [also labelled Y153]
Y154: K155.7 K159.7 L1.78  [also labelled Y155]
Y156: K154.7 K158.7 L1.79  [also labelled Y157]
Y158: K153.7 K157.7 L1.80  [also labelled Y159]
Y160: K164.7 K168.7 L1.81  [also labelled Y161]
Y162: K163.7 K167.7 L1.82  [also labelled Y163]
Y164: K162.7 K166.7 L1.83  [also labelled Y165]
Y166: K161.7 K165.7 L1.84  [also labelled Y167]
Y168: K172.7 K176.7 L1.85  [also labelled Y169]
Y170: K171.7 K175.7 L1.86  [also labelled Y171]
Y172: K170.7 K174.7 L1.87  [also labelled Y173]
Y174: K169.7 K173.7 L1.88  [also labelled Y175]
Y176: K180.7 K184.7 L1.89  [also labelled Y177]
Y178: K179.7 K183.7 L1.90  [also labelled Y179]
Y180: K178.7 K182.7 L1.91  [also labelled Y181]
Y182: K177.7 K181.7 L1.92  [also labelled Y183]
Y184: K188.7 K192.7 L1.93  [also labelled Y185]
Y186: K187.7 K191.7 L1.94  [also labelled Y187]
Y188: K186.7 K190.7 L1.95  [also labelled Y189]
Y190: K185.7 K189.7 L1.96  [also labelled Y191]
NetD0_9: D0.9(QS1) D1.2(D)
NetD1_9: D1.9(QS1) D2.2(D)
NetD2_9: D2.9(QS1) D3.2(D)
NetD3_9: D3.9(QS1) D4.2(D)
NetD4_9: D4.9(QS1) D5.2(D)
NetD5_9: D5.9(QS1) D6.2(D)
NetD6_9: D6.9(QS1) D7.2(D)
NetD7_9: D7.9(QS1) D8.2(D)
NetD8_9: D8.9(QS1) D9.2(D)
NetD9_9: D9.9(QS1) D10.2(D)
NetD10_9: D10.9(QS1) D11.2(D)
NetD11_9: D11.9(QS1) D12.2(D)
NetD12_9: D12.9(QS1) D13.2(D)
NetD13_9: D13.9(QS1) D14.2(D)
NetD14_9: D14.9(QS1) D15.2(D)
NetD15_9: D15.9(QS1) D16.2(D)
NetD16_9: D16.9(QS1) D17.2(D)
NetD17_9: D17.9(QS1) D18.2(D)
NetD18_9: D18.9(QS1) D19.2(D)
NetD19_9: D19.9(QS1) D20.2(D)
NetD20_9: D20.9(QS1) D21.2(D)
NetD21_9: D21.9(QS1) D22.2(D)
NetD22_9: D22.9(QS1) D23.2(D)

Not connected (* = marked no-connect by the designer): D0 10(QS2); D1 10(QS2); D2 10(QS2); D3 10(QS2); D4 10(QS2); D5 10(QS2); D6 10(QS2); D7 10(QS2) 14(QP4); D8 10(QS2); D9 10(QS2); D10 10(QS2); D11 10(QS2); D12 10(QS2); D13 10(QS2); D14 10(QS2); D15 10(QS2); D16 10(QS2); D17 10(QS2); D18 10(QS2); D19 10(QS2); D20 10(QS2); D21 10(QS2); D22 10(QS2); D23 10(QS2); PLD1 10

## Buses and harness runs
bus D0[0..7]
bus D1[0..7]
bus D2[0..7]
bus D3[0..7]
bus D4[0..7]
bus D5[0..7]
bus D6[0..7]
bus D7[0..7]
bus D8[0..7]
bus D9[0..7]
bus D10[0..7]
bus D11[0..7]
bus D12[0..7]
bus D13[0..7]
bus D14[0..7]
bus D15[0..7]
bus D16[0..7]
bus D17[0..7]
bus D18[0..7]
bus D19[0...7]
bus D20[0..7]
bus D21[0..7]
bus D22[0..7]
bus D23[0..7]

## Notes on the sheet
- Labels drawn without touching a wire or pin: D7-4

## Library data of the parts
D0-D23 = Component_1: Deshifrator
K1-K192 = TRR1A05D00
L1 = DIN41612
VD1-VD192 = Диод